# Altium schematic sheet main.SchDoc
size B
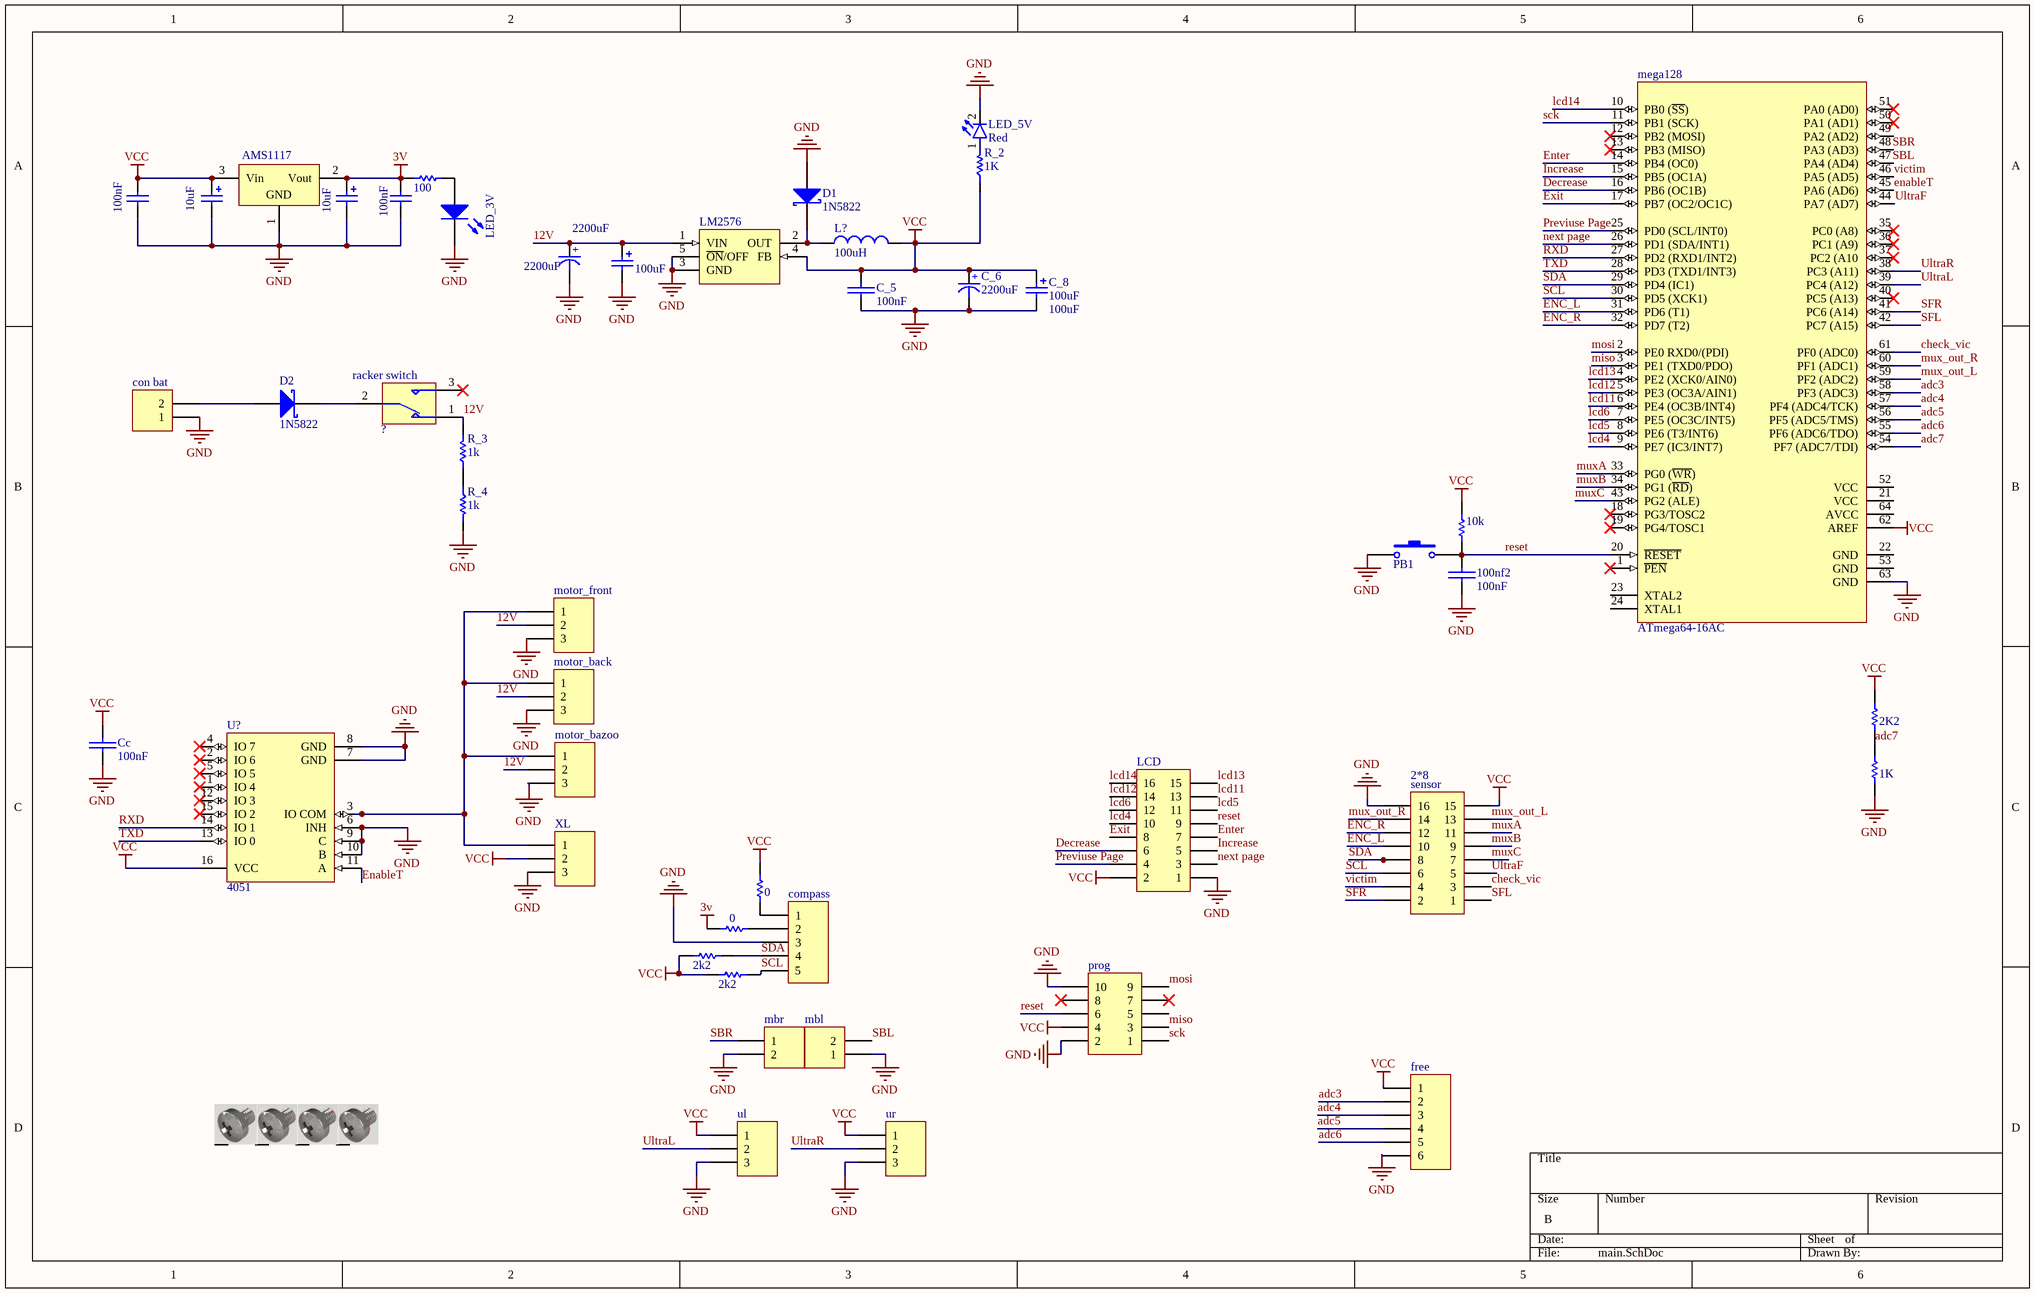
[diagram p0: main.SchDoc]

## Parts
100nf2  100nF  [CAP 0805]
?  racker switch  [switch racker]
C_1  100nF  [CAP 0805]
C_1  100uF  [CAP 2]
C_2  10uF  [CAP 1.5]
C_3  10uF  [CAP 1.5]
C_4  100nF  [CAP 0805]
C_5  100nF  [cap 0805]
C_6  2200uF  [CAP 3]
C_8  100uF  [Cap 2]
C_?  2200uF  [CAP 3]
Cc  100nF  [CAP 0805]
compass  cmps  [CON M 5 right]  (value not drawn)
con_bat  CON 2  [CON T battery]  (value not drawn)
D1  1N5822  [Diode 5822 SMC]
D2  1N5822  [Diode 5822 SMC]
free  CON 6  [CON M 6]  (value not drawn)
jump  0  [RES 0805]
L?  100uH  [Inductor_12x12_SMD]
LCD  LCD PORT  [CON IDC 2X8]  (value not drawn)
LED_3V  LED  [LED 1206]  (value not drawn)
LED_5V  Red  [LED 0805]
LM2576  LM2576_ADJ  [LM2576 SMD]  (value not drawn)
mbl  CON 2  [CON M 2]  (value not drawn)
mbr  CON 2  [CON M 2]  (value not drawn)
mega128  ATmega64-16AC  [DIP-64 rec2]
motor_back  CON 3  [con Pingerd 3]  (value not drawn)
motor_bazoo  CON 3  [con Pingerd 3]  (value not drawn)
motor_front  CON 3  [con Pingerd 3]  (value not drawn)
p1  Screw  [Board Screw]  (value not drawn)
p2  Screw  [Board Screw]  (value not drawn)
p3  Screw  [Board Screw]  (value not drawn)
p4  Screw  [Board Screw]  (value not drawn)
PB1  PUSH BUTTON  [push button]  (value not drawn)
prog  prog  [CON IDC 2x5]  (value not drawn)
R1  10k  [RES 0805]
R_  2k2  [RES 0805]
R_1  100  [RES 0805]
R_2  1K  [RES 0805]
R_3  1k  [RES 0805]
R_4  1k  [RES 0805]
R_6  0  [RES 0805]
R_pullup  2k2  [RES 0805]
Rbat1  1K  [RES 0805]
Rbat2  2K2  [RES 0805]
REG?  AMS1117  [AMS1117]
sensor  2*8  [CON IDC 2X8]
U?  4051  [SO-16]
ul  CON 3  [CON M 3]  (value not drawn)
ur  CON 3  [CON M 3]  (value not drawn)
XL  CON 3  [CON PH 3]  (value not drawn)

## Nets
3v: C_3.1 C_4.2 jump.1 R_1.1 REG?.2(Vout)
GND: 100nf2.1(+) C_1.1 C_1.2 C_2.2 C_3.2 C_4.1 C_5.2(-) C_6.2(-) C_8.2 C_?.2(-) Cc.2(-) compass.3 con_bat.1 D1.1(A) free.6 LCD.1 LED_3V.2(K) LED_5V.2(K) LM2576.3(GND) LM2576.5(~{ON}/OFF) mbl.1 mbr.2 mega128.63(GND) motor_back.3 motor_bazoo.3 motor_front.3 PB1.1 prog.2 prog.10 R_4.2 Rbat1.1 REG?.1(GND) sensor.16 U?.6(INH) U?.7(GND) U?.8(GND) U?.9(C) U?.10(B) ul.3 ur.3 XL.3
VCC: C_1.2 C_2.1 C_5.1(+) C_6.1(+) C_8.1 Cc.1(+) free.1 L?.2 LCD.2 LM2576.4(FB) mega128.62(AREF) prog.4 R1.2 R_.1 R_2.1 R_6.2 R_pullup.1 Rbat2.2 REG?.3(Vin) sensor.15 U?.16(VCC) ul.1 ur.1 XL.2
12V: ?.1 C_1.1 C_?.1(+) LM2576.1(VIN) motor_back.2 motor_bazoo.2 motor_front.2 R_3.2
adc3: free.2 mega128.58(PF3_(ADC3))
adc4: free.3 mega128.57(PF4_(ADC4/TCK))
adc5: free.4 mega128.56(PF5_(ADC5/TMS))
adc6: free.5 mega128.55(PF6_(ADC6/TDO))
adc7: mega128.54(PF7_(ADC7/TDI)) Rbat1.2 Rbat2.1
check_vic: mega128.61(PF0_(ADC0)) sensor.3
Decrease: LCD.6 mega128.16(PB6_(OC1B))
enableT: mega128.45(PA6_(AD6)) U?.11(A)
ENC_L: mega128.31(PD6_(T1)) sensor.10
ENC_R: mega128.32(PD7_(T2)) sensor.12
Enter: LCD.7 mega128.14(PB4_(OC0))
Exit: LCD.8 mega128.17(PB7_(OC2/OC1C))
Increase: LCD.5 mega128.15(PB5_(OC1A))
lcd4: LCD.10 mega128.9(PE7_(IC3/INT7))
lcd5: LCD.11 mega128.8(PE6_(T3/INT6))
lcd6: LCD.12 mega128.7(PE5_(OC3C/INT5))
lcd11: LCD.13 mega128.6(PE4_(OC3B/INT4))
lcd12: LCD.14 mega128.5(PE3_(OC3A/AIN1))
lcd13: LCD.15 mega128.4(PE2_(XCK0/AIN0))
lcd14: LCD.16 mega128.10(PB0_(~{SS}))
miso: mega128.3(PE1_(TXD0/PDO)) prog.3
mosi: mega128.2(PE0_RXD0/(PDI)) prog.9
mux_out_L: mega128.59(PF2_(ADC2)) sensor.13
mux_out_R: mega128.60(PF1_(ADC1)) sensor.14
muxA: mega128.33(PG0_(~{WR})) sensor.11
muxB: mega128.34(PG1_(~{RD})) sensor.9
muxC: mega128.43(PG2_(ALE)) sensor.7
next page: LCD.3 mega128.26(PD1_(SDA/INT1))
Previuse Page: LCD.4 mega128.25(PD0_(SCL/INT0))
reset: 100nf2.2(-) LCD.9 mega128.20(~{RESET}) PB1.2 prog.6 R1.1
RXD: mega128.27(PD2_(RXD1/INT2)) U?.14(IO_1)
SBL: mbl.2 mega128.47(PA4_(AD4))
SBR: mbr.1 mega128.48(PA3_(AD3))
sck: mega128.11(PB1_(SCK)) prog.1
SCL: compass.5 mega128.30(PD5_(XCK1)) R_pullup.2 sensor.6
SDA: compass.4 mega128.29(PD4_(IC1)) R_.2 sensor.8
SFL: mega128.42(PC7_(A15)) sensor.1
SFR: mega128.41(PC6_(A14)) sensor.2
TXD: mega128.28(PD3_(TXD1/INT3)) U?.13(IO_0)
UltraF: mega128.44(PA7_(AD7)) sensor.5
UltraL: mega128.39(PC4_(A12)) ul.2
UltraR: mega128.38(PC3_(A11)) ur.2
victim: mega128.46(PA5_(AD5)) sensor.4
Net?_2: ?.2 D2.2(K)
Netcompass_1: compass.1 R_6.1
Netcompass_2: compass.2 jump.2
Netcon_bat_2: con_bat.2 D2.1(A)
NetD1_2: D1.2(K) L?.1 LM2576.2(OUT)
NetLED_3V_1: LED_3V.1(A) R_1.2
NetLED_5V_1: LED_5V.1(A) R_2.2
Netmotor_back_1: motor_back.1 motor_bazoo.1 motor_front.1 U?.3(IO_COM) XL.1
NetR_3_1: R_3.1 R_4.1

Not connected (* = marked no-connect by the designer): ? 3*; mega128 1(~{PEN})* 12(PB2_(MOSI))* 13(PB3_(MISO))* 18(PG3/TOSC2)* 19(PG4/TOSC1)* 21(VCC) 22(GND) 23(XTAL2) 24(XTAL1) 35(PC0_(A8))* 36(PC1_(A9))* 37(PC2_(A10)* 40(PC5_(A13))* 49(PA2_(AD2)) 50(PA1_(AD1))* 51(PA0_(AD0))* 52(VCC) 53(GND) 64(AVCC); p1 S; p2 S; p3 S; p4 S; prog 5 7* 8*; U? 1(IO_4)* 2(IO_6)* 4(IO_7)* 5(IO_5)* 12(IO_3)* 15(IO_2)*

## Library data of the parts
100nf2 C_5 Cc = Cap-Bipolar: Bipolar Capacitor; Voltage: 100V; Designer: Saeid Jorablo; Organazation: ControTec; Adding Date: 1387/12/20; Value: 100nF
? = Switch SPDT_Subminiator: Subminiator SPDT Switch; Company: E.P.I.L; Design date: 2011/11/02
C_1 C_4 = Cap: Capacitor; Published: 8-Jun-2000; LatestRevisionDate: 17-Jul-2002; LatestRevisionNote: Re-released for DXP Platform.; PackageReference: RAD-0.3; Publisher: Altium Limited; Value: 100nF
C_1 C_3 C_8 = Cap Pol1: Polarized Capacitor (Radial); Published: 8-Jun-2000; LatestRevisionDate: 17-Jul-2002; LatestRevisionNote: Re-released for DXP Platform.; PackageReference: RB7.6-15; Publisher: Altium Limited
  C_1 C_8: Value: 100uF
  C_3: Value: 10uF
C_2 = Cap: Polarized Capacitor (Radial); Published: 8-Jun-2000; LatestRevisionDate: 17-Jul-2002; LatestRevisionNote: Re-released for DXP Platform.; PackageReference: RB7.6-15; Publisher: Altium Limited; Value: 10uF
C_6 C_? = Cap-Polar: Polar Capacitor; Designer: Saeid Jorablo; Organazation: ControTec; Voltage: 16V; Adding Date: 1387/12/20; Value: 2200uF
compass = CON 5: Header, 4-Pin; LatestRevisionDate: 17-Jul-2002; LatestRevisionNote: Re-released for DXP Platform.; Publisher: Altium Limited
con_bat mbl mbr = CON 2: Header, 2-Pin; LatestRevisionDate: 17-Jul-2002; LatestRevisionNote: Re-released for DXP Platform.; Publisher: Altium Limited
D1 D2 = D Schottky: Schottky Diode; Published: 8-Jun-2000; LatestRevisionDate: 17-Jul-2002; LatestRevisionNote: Re-released for DXP Platform.; PackageReference: SMB; Publisher: Altium Limited; PackageDescription: DO-214-AA/SMB; 2 C-Bend Leads; Body 5.3 x 3.6 mm, inc. leads (LxW); Code_JEDEC: DO-214-AA
free = CON 6: Header, 6-Pin; LatestRevisionDate: 17-Jul-2002; LatestRevisionNote: Re-released for DXP Platform.; Publisher: Altium Limited
jump R_1 Rbat1 Rbat2 = Res: Resistor; Published: 8-Jun-2000; LatestRevisionDate: 17-Jul-2002; LatestRevisionNote: Re-released for DXP Platform.; PackageReference: AXIAL-0.3; Publisher: Altium Limited
  jump: Value: 0
  R_1: Value: 100
  Rbat1: Value: 1K
  Rbat2: Value: 2K2
L? = Inductor: Code_IEC: 1005; 100uH: 100mH; Published: 8-Jun-2000; LatestRevisionDate: 29-May-2009; LatestRevisionNote: IPC-7351 Footprint Added.; PackageReference: 0402-A; Publisher: Altium Limited; PackageDescription: Chip Inductor; Code_JEITA: 0402
LCD sensor = Header 8X2: Header, 8-Pin, Dual row; LatestRevisionDate: 17-Jul-2002; LatestRevisionNote: Re-released for DXP Platform.; Publisher: Altium Limited
LED_3V = LED: Typical INFRARED GaAs LED; Published: 8-Jun-2000; LatestRevisionDate: 08-Jul-2005; LatestRevisionNote: Mech Layer 1 removed.; PackageReference: LED-0; Publisher: Altium Limited
LED_5V = LED: Designer: Saeid Jorablo; Organazation: ControTec; Adding Date: 1387/12/22; Color: Red
LM2576 = LM2576D2T-ADJ: Note: Pin 3 is electrically connected to Pin 6;Pin 6 is heatsink; Published: 15-Apr-2002; DatasheetVersion: Jul-1999; PackageVersion: Jul-1999; PackageReference: 936A-02; Publisher: Altium Limited; PackageDescription: D2-PAK; 5 Leads; Body 14.7 (inc. leads) x 10.2 mm (LxW max); ComponentLink1Description: Manufacturer Link; ComponentLink1URL: http://www.onsemi.com/site/products/taxonomy/0,4438,503,00.html; ComponentLink2Description: Datasheet; ComponentLink2URL: http://www.onsemi.com/pub/Collateral/LM2576-D.PDF
mega128 = ATmega64-16AC: 8-Bit AVR Microcontroller with 64K Bytes of In-System Programmable Flash Memory; Published: 17-Sep-2003; LatestRevisionDate: 13-Apr-2006; LatestRevisionNote: IPC-7351 Footprint Added.; DatasheetVersion: 2490C-AVR-009/02; PackageVersion: revB, Oct-2001; PackageReference: 64A; Publisher: Altium Limited; PackageDescription: 64-Pin Thin Quad Flat Pack 0.8 mm Pitch; Code_JEDEC: MS-026-AEB; ComponentLink1Description: Manufacturer Link; ComponentLink1URL: http://www.atmel.com; ComponentLink2Description: Datasheet; ComponentLink2URL: http://www.atmel.com/dyn/resources/prod_documents/doc2490.pdf
motor_back motor_bazoo motor_front ul ur XL = CON 3: CONECTOR, 3-Pin; LatestRevisionDate: 17-Jul-2002; LatestRevisionNote: Re-released for DXP Platform.; Publisher: Altium Limited
p1-p4 = Board Screw: Board Screw With Spacer
PB1 = PUSH BUTTON: Switch; Published: 24-Mar-1999; LatestRevisionDate: 17-Jul-2002; LatestRevisionNote: Re-released for DXP Platform.; PackageReference: SPST-2; Publisher: Altium Limited
prog = Header 5X2: Header, 5-Pin, Dual row; LatestRevisionDate: 17-Jul-2002; LatestRevisionNote: Re-released for DXP Platform.; Publisher: Altium Limited
R1 R_ R_6 R_pullup = Res: Resistor; Value: 1K; Published: 8-Jun-2000; LatestRevisionDate: 17-Jul-2002; LatestRevisionNote: Re-released for DXP Platform.; PackageReference: AXIAL-0.3; Publisher: Altium Limited
R_2-R_4 = Resistor
  R_2: Value: 1K
  R_3 R_4: Value: 1k
REG? = AMS1117: Voltage Regulator; Published: 24-Mar-1999; LatestRevisionDate: 17-Jul-2002; LatestRevisionNote: Re-released for DXP Platform.; PackageReference: D2PAK; Publisher: Altium Limited; Code_JEDEC: SMD-220
U? = 4051: Analog Multiplexer/Demultiplexer; Published: 8-Jun-2000; LatestRevisionDate: 06-Jun-2005; LatestRevisionNote: Stylized 3D Model Added.; DatasheetVersion: Jun-1989; PackageVersion: Apr-1996; PackageReference: DIP16; Publisher: Altium Limited; PackageDescription: DIP; 16 Leads; Row Spacing 7.62 mm; Pitch 2.54 mm; ComponentLink1Description: Manufacturer Link; ComponentLink1URL: http://www.st.com/; ComponentLink2Description: Datasheet; ComponentLink2URL: http://www.st.com/stonline/products/literature/ds/2053/hcf4051.pdf